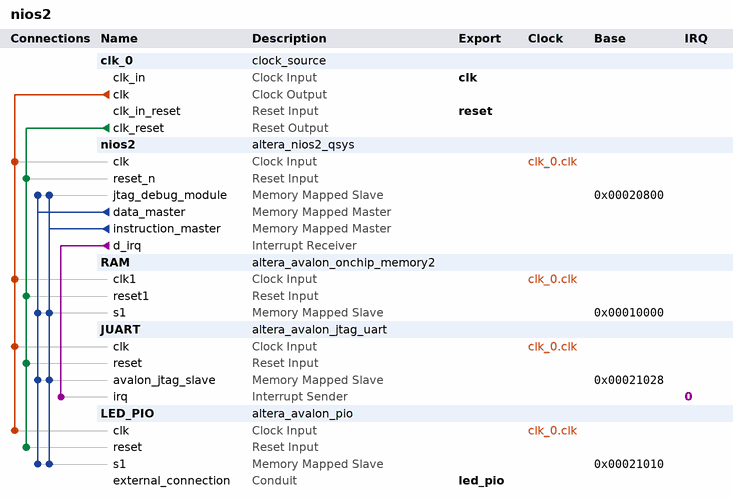
[diagram p0: system contents]
# Platform Designer (Qsys) system nios2, Cyclone V 5CSXFC6D6F31C6
# Parameters at their usual value, and those the tool derives, are not listed.
package require -exact qsys 13.0.1.99.2
create_system nios2
set_project_property DEVICE_FAMILY {Cyclone V}
set_project_property DEVICE 5CSXFC6D6F31C6

add_instance clk_0 clock_source 13.0
set_instance_parameter_value clk_0 clockFrequency 50000000

add_instance nios2 altera_nios2_qsys 13.0
set_instance_parameter_value nios2 resetSlave RAM.s1
set_instance_parameter_value nios2 mmu_TLBMissExcSlave None
set_instance_parameter_value nios2 exceptionSlave RAM.s1
set_instance_parameter_value nios2 breakSlave nios2.jtag_debug_module
set_instance_parameter_value nios2 impl Tiny
set_instance_parameter_value nios2 icache_size 4096

add_instance RAM altera_avalon_onchip_memory2 13.0.1.99.2
set_instance_parameter_value RAM dataWidth 32
set_instance_parameter_value RAM dualPort false
set_instance_parameter_value RAM initMemContent true
set_instance_parameter_value RAM initializationFileName onchip_mem.hex
set_instance_parameter_value RAM memorySize 40960

add_instance JUART altera_avalon_jtag_uart 13.0.1.99.2
set_instance_parameter_value JUART simInteractiveOptions NO_INTERACTIVE_WINDOWS

add_instance LED_PIO altera_avalon_pio 13.0.1.99.2
set_instance_parameter_value LED_PIO direction Output
set_instance_parameter_value LED_PIO width 8

# connections
add_connection clk_0.clk JUART.clk clock
add_connection clk_0.clk LED_PIO.clk clock
add_connection clk_0.clk nios2.clk clock
add_connection clk_0.clk RAM.clk1 clock
add_connection clk_0.clk_reset JUART.reset reset
add_connection clk_0.clk_reset LED_PIO.reset reset
add_connection clk_0.clk_reset nios2.reset_n reset
add_connection clk_0.clk_reset RAM.reset1 reset
add_connection nios2.data_master JUART.avalon_jtag_slave avalon
set_connection_parameter_value nios2.data_master/JUART.avalon_jtag_slave baseAddress 0x00021028
add_connection nios2.data_master LED_PIO.s1 avalon
set_connection_parameter_value nios2.data_master/LED_PIO.s1 baseAddress 0x00021010
add_connection nios2.data_master nios2.jtag_debug_module avalon
set_connection_parameter_value nios2.data_master/nios2.jtag_debug_module baseAddress 0x00020800
add_connection nios2.data_master RAM.s1 avalon
set_connection_parameter_value nios2.data_master/RAM.s1 baseAddress 0x00010000
add_connection nios2.instruction_master JUART.avalon_jtag_slave avalon
set_connection_parameter_value nios2.instruction_master/JUART.avalon_jtag_slave baseAddress 0x00021028
add_connection nios2.instruction_master LED_PIO.s1 avalon
set_connection_parameter_value nios2.instruction_master/LED_PIO.s1 baseAddress 0x00021010
add_connection nios2.instruction_master nios2.jtag_debug_module avalon
set_connection_parameter_value nios2.instruction_master/nios2.jtag_debug_module baseAddress 0x00020800
add_connection nios2.instruction_master RAM.s1 avalon
set_connection_parameter_value nios2.instruction_master/RAM.s1 baseAddress 0x00010000
add_connection nios2.d_irq JUART.irq interrupt
set_connection_parameter_value nios2.d_irq/JUART.irq irqNumber 0

# exported interfaces
add_interface clk clock sink
set_interface_property clk EXPORT_OF clk_0.clk_in
add_interface led_pio conduit end
set_interface_property led_pio EXPORT_OF LED_PIO.external_connection
add_interface reset reset sink
set_interface_property reset EXPORT_OF clk_0.clk_in_reset

set_interconnect_requirement {$system} qsys_mm.clockCrossingAdapter HANDSHAKE
set_interconnect_requirement {$system} qsys_mm.maxAdditionalLatency 1
set_interconnect_requirement {$system} qsys_mm.insertDefaultSlave false

save_system nios2.qsys
